# Altium schematic sheet sw.SchDoc
size A
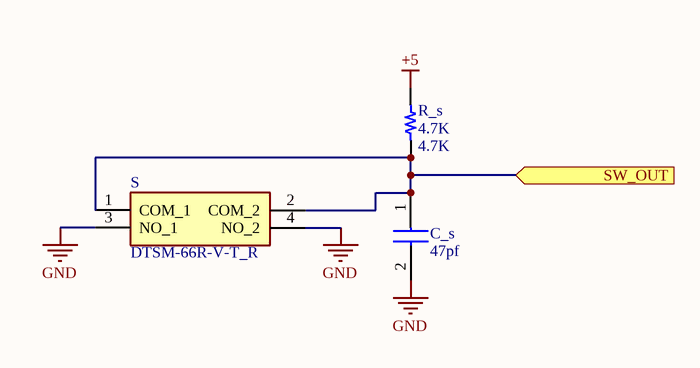
[diagram p0: sw.SchDoc]

## Parts
C_s  47pf  [0603C]
R_s  4.7K  [0603R]
S  DTSM-66R-V-T_R  [DTSM63NVB]

## Ports
SW_OUT (in)

## Nets
+5: R_s.2
GND: C_s.2 S.3(NO_1) S.4(NO_2)
SW_OUT: C_s.1 R_s.1 S.1(COM_1) S.2(COM_2) ; port SW_OUT

## Library data of the parts
C_s = C1206C104Z5UACTU: 100 nF Ceramic capacitor; Manufacturer_Name: Kemet; Datasheet Link: https://componentsearchengine.com/Datasheets/1/C1206C104Z5UACTU.pdf; Height: 0.88mm; Manufacturer_Part_Number: C1206C104Z5UACTU; Mouser Part Number: 80-C1206C104Z5U; Mouser Price/Stock: https://www.mouser.com/Search/Refine.aspx?Keyword=80-C1206C104Z5U
R_s = Resistor: RES SMD 100K OHM 1% 0.4W 0805; Part Number: RCS0805100KFKEA; Value: 4.7K
S = DTSM-66R-V-T_R: Switch; Manufacturer_Name: Diptronics; Manufacturer_Part_Number: DTSM-66R-V-T/R; Datasheet Link: https://www.mouser.co.uk/datasheet/2/910/464_DTSMJ-6-1571536.pdf; Height: 7.1mm; Mouser Part Number: 113-DTSM66RVTR; Mouser Price/Stock: https://www.mouser.co.uk/ProductDetail/Diptronics/DTSM-66R-V-T-R?qs=MLItCLRbWsxl2%252BVY862AIw%3D%3D